# EAGLE design Linear_scale_digitizer (EAGLE 9.2.0)
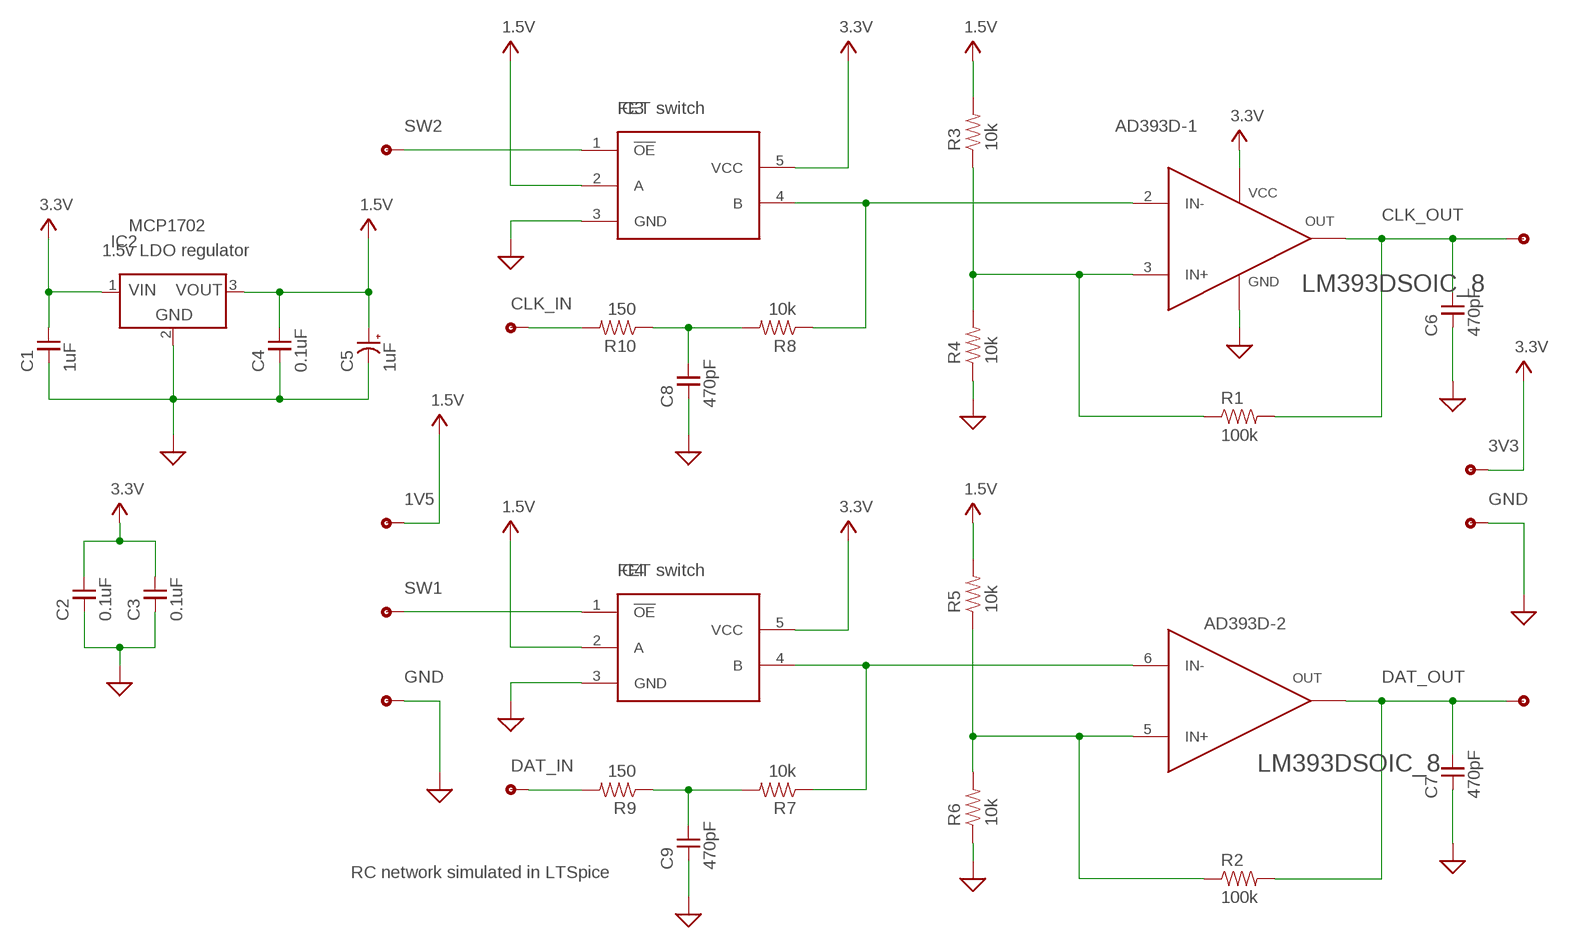
[diagram p0: schematic, sheet 1]

## Parts
C1  1uF  CAPACITOR0805  [0805]
C2  0.1uF  CAPACITOR0805  [0805]
C3  0.1uF  CAPACITOR0805  [0805]
C4  0.1uF  CAPACITOR0805  [0805]
C5  1uF  CAPACITOR+0805  [0805]
C6  470pF  CAPACITOR0805  [0805]
C7  470pF  CAPACITOR0805  [0805]
C8  470pF  CAPACITOR0805  [0805]
C9  470pF  CAPACITOR0805  [0805]
IC1  LM393DSOIC_8  [SO_8]
IC2  MCP1702  [SOT-23A]
IC3  SN74CB3T1G125  [SOT_23-5]
IC4  SN74CB3T1G125  [SOT_23-5]
R1  100k  RESISTORSMD0805  [0805]
R2  100k  RESISTORSMD0805  [0805]
R3  10k  RESISTORSMD0805  [0805]
R4  10k  RESISTORSMD0805  [0805]
R5  10k  RESISTORSMD0805  [0805]
R6  10k  RESISTORSMD0805  [0805]
R7  10k  RESISTORSMD0805  [0805]
R8  10k  RESISTORSMD0805  [0805]
R9  150  RESISTORSMD0805  [0805]
R10  150  RESISTORSMD0805  [0805]
TP1  TP  [TP]
TP2  TP  [TP]
TP3  TP  [TP]
TP4  TP  [TP]
TP5  TP  [TP]
TP6  TP  [TP]
TP7  TP  [TP]
TP8  TP  [TP]
TP9  TP  [TP]
TP10  TP  [TP]

## Nets
1V5: C4.2 C5.1 IC2.3(VOUT) IC3.2(A) IC4.2(A) R3.2 R5.2 TP7.P$1 ; supply symbol labelled 1.5V
3V3: C1.2 C2.2 C3.2 IC1.8(VCC) IC2.1(VIN) IC3.5(VCC) IC4.5(VCC) TP10.P$1 ; supply symbol labelled 3.3V
CLK_IN: R10.2 TP5.P$1
CLK_OUT: C6.2 IC1.1(OUT) R1.2 TP1.P$1
DAT_IN: R9.2 TP6.P$1
DAT_OUT: C7.2 IC1.7(OUT) R2.2 TP2.P$1
GND: C1.1 C2.1 C3.1 C4.1 C5.2 C6.1 C7.1 C8.1 C9.1 IC1.4(GND) IC2.2(GND) IC3.3(GND) IC4.3(GND) R4.1 R6.1 TP8.P$1 TP9.P$1 ; supply symbol labelled AGND
N$1: IC1.5(IN+) R2.1 R5.1 R6.2
N$3: IC1.3(IN+) R1.1 R3.1 R4.2
N$4: C8.2 R8.2 R10.1
N$5: IC1.6(IN-) IC4.4(B) R7.1
N$6: IC1.2(IN-) IC3.4(B) R8.1
N$8: C9.2 R7.2 R9.1
SW1: IC4.1(!OE) TP4.P$1
SW2: IC3.1(!OE) TP3.P$1

## Notes on the sheet
- FET switch
- AD393D-1
- 1.5v LDO regulator
- FET switch
- AD393D-2
- RC network simulated in LTSpice

## Library data of the parts
C1-C4 C6-C9 = thomas_library:CAPACITOR: This is a capacitor
C5 = thomas_library:CAPACITOR+: This is a polarized capacitor
IC1 = thomas_library:LM393D: The LM393D is a dual comparator from Texas Instruments
IC2 = thomas_library:MCP1702
IC3 IC4 = thomas_library:SN74CB3T1G125
R1-R10 = thomas_library:RESISTOR: This is a resistor
TP1-TP10 = thomas_library:TP: A test point

## Board
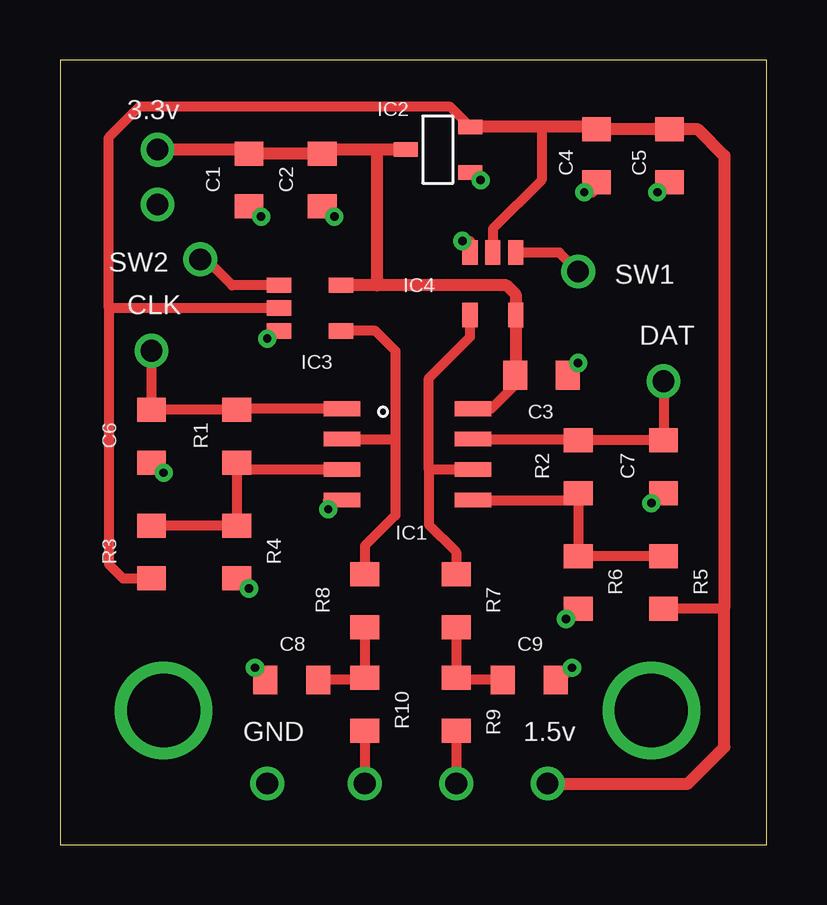
[diagram p1: board, top side]
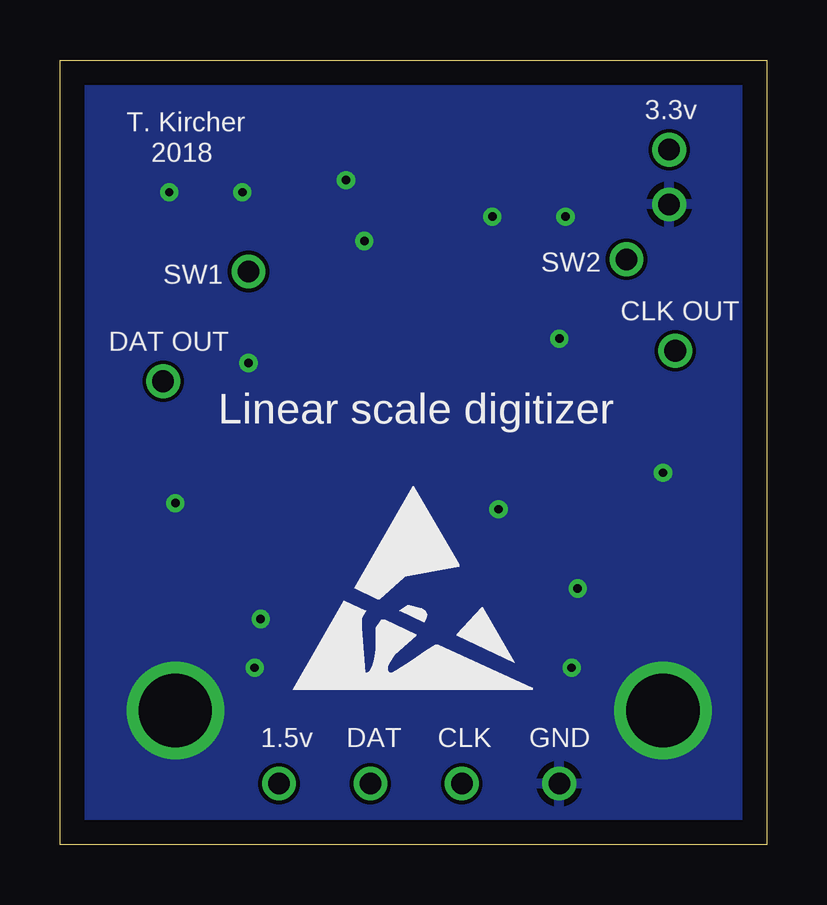
[diagram p2: board, bottom side, seen from below]

Size 29.44 x 32.69 mm. Coordinates in mm from the lower left corner, seen from the top.
Outline: 0,0 29.44,0 29.44,32.69 0,32.69 0,0
Copper layers (1*16): Top 0.035mm / dielectric 1.5mm / Bottom 0.035mm
Design rules "default": minimum track width 6mil, minimum drill 0.35mm, track to track 6mil, track to pad 6mil, pad to pad 6mil, via to via 6mil, smd to smd 6mil, copper to edge 40mil, drill to drill 6mil, minimum pad ring 10mil, minimum via ring 8mil, stop-mask expansion 4mil, vias tented up to drill 0mil, thermal gap 10mil

### Footprints (pad centres in the part's own frame; a part is rotated, then mirrored left to right if it is on the bottom)
0805 = smd 1 x 1.2: 1 -1.1,0; 2 1.1,0
SO_8 = smd 1.524 x 0.61: 1 -2.731,1.905; 2 -2.731,0.635; 3 -2.731,-0.635; 4 -2.731,-1.905; 5 2.731,-1.905; 6 2.731,-0.635; 7 2.731,0.635; 8 2.731,1.905
SOT-23A = smd 0.6 x 1: 1 0,1.35; 2 -0.95,-1.35; 3 0.95,-1.35
SOT_23-5 = smd 0.635 x 1.016: 1 -0.953,-1.295; 2 0,-1.295; 3 0.953,-1.295; 4 0.953,1.295; 5 -0.953,1.295
TP = drill 0.9: P$1 0,0

### Placement (x,y rotation side)
C1  7.87,27.69 90 top
C2  10.92,27.69 90 top
C3  20.07,19.56 180 top
C4  22.35,28.7 90 top
C5  25.4,28.7 270 top
C6  3.81,17.02 90 top
C7  25.15,15.75 90 top
C8  9.65,6.86 0 top
C9  19.56,6.86 180 top
IC1  14.48,16.26 0 top
IC2  15.75,28.96 90 top
IC3  10.41,22.35 270 top
IC4  18.03,23.37 180 top
R1  7.37,17.02 90 top
R2  21.59,15.75 90 top
R3  3.81,12.19 270 top
R4  7.37,12.19 90 top
R5  25.15,10.92 270 top
R6  21.59,10.92 90 top
R7  16.51,10.16 270 top
R8  12.7,10.16 270 top
R9  16.51,5.84 270 top
R10  12.7,5.84 270 top
TP1  3.81,20.57 0 top
TP2  25.15,19.3 0 top
TP3  5.84,24.38 0 top
TP4  21.59,23.88 0 top
TP5  12.7,2.54 0 top
TP6  16.51,2.54 0 top
TP7  20.32,2.54 0 top
TP8  8.64,2.54 0 top
TP9  4.06,26.67 0 top
TP10  4.06,28.96 0 top
U$7  [ESD_10.00]  19.81,6.35 0 bottom

### Tracks (layer width: path | path; a pad name or v marks a point on that pad's centre or on a via)
1V5
  Top 0.406: C4.2 22.25,29.91 | R5.2 27.6,9.82 27.69,9.91 | R3.2 2.62,11.09 2.03,11.68 2.03,22.35 | IC3.2 2.03,22.35 | IC4.2 18.03,25.65 20.07,27.69 20.07,29.91 | 2.03,22.35 2.03,29.46 3.3,30.73 16.27,30.73 IC2.3
  Top 0.508: 22.25,29.91 20.07,29.91 IC2.3 | C4.2 C5.1 26.59,29.8 27.69,28.7 27.69,9.91 27.69,4.06 26.16,2.54 TP7.P$1
3V3
  Top 0.406: C3.2 18.97,19.16 17.97,18.16 IC1.8
  Top 0.508: C3.2 18.99,19.58 IC4.5 18.99,22.92 18.61,23.3 13.21,23.3 | 13.21,23.3 IC3.5 | IC2.1 13.21,28.96 | 13.21,28.96 11.09,28.96 C2.2 C1.2 7.7,28.96 TP10.P$1 | 13.21,28.96 13.21,23.3
CLK_IN
  Top 0.406: R10.2 TP5.P$1
CLK_OUT
  Top 0.406: IC1.1 7.41,18.16 R1.2 C6.2 TP1.P$1
DAT_IN
  Top 0.406: R9.2 TP6.P$1
DAT_OUT
  Top 0.406: IC1.7 21.55,16.89 R2.2 C7.2 TP2.P$1
GND  (via drill 0.35, 3.05)
  Top 0.406: C5.2 24.98,27.18 v24.89,27.18 | C4.1 22.35,27.35 22.18,27.18 v21.84,27.18 | v17.53,27.69 17.42,27.69 IC2.2 | v21.59,20.07 21.17,19.64 C3.1 | C7.1 24.72,14.22 v24.64,14.22 | R6.1 21.51,9.82 v21.08,9.4 | v21.34,7.37 20.83,6.86 C9.1 | v11.43,26.16 11.09,26.59 C2.1 | v8.38,26.16 8.3,26.16 C1.1 | IC1.4 11.18,14.35 v11.18,13.97 | v7.87,10.67 7.37,11.18 R4.1 | v8.13,7.37 8.59,6.9 C8.1 | v4.32,15.49 4.15,15.66 4.06,15.66 C6.1 | IC3.3 8.95,21.4 v8.64,21.08 | v16.76,25.15 17.08,25.15 IC4.3
  other vias: 4.32,5.59 24.64,5.59
  pour Bottom: 0.25,32.51 29.21,32.51 29.21,1.02 0.25,1.02
N$1
  Top 0.406: IC1.5 21.29,14.35 R2.1 R6.2 R5.1
N$3
  Top 0.406: IC1.3 7.66,15.62 R1.1 R4.2 R3.1
N$4
  Top 0.406: R8.2 R10.1 12.62,6.86 C8.2
N$5
  Top 0.406: IC1.6 15.37,15.62 | 15.37,15.62 15.37,13.34 16.51,12.19 R7.1 | 15.37,15.62 15.37,19.43 17.08,21.15 IC4.4
N$6
  Top 0.406: IC1.2 13.84,16.89 13.97,16.76 | 13.97,16.76 13.97,13.72 12.7,12.45 R8.1 | IC3.4 13.14,21.4 13.97,20.57 13.97,16.76
N$8
  Top 0.406: R7.2 R9.1 16.51,6.86 C9.2
SW1
  Top 0.406: TP4.P$1 20.8,24.66 IC4.1
SW2
  Top 0.406: IC3.1 7.18,23.3 6.1,24.38 TP3.P$1

### Text on the board
tNames: 3.3v | SW2 | SW1 | CLK | DAT | GND | 1.5v
bNames: 3.3v | T. Kircher | 2018 | SW2 | SW1 | CLK OUT | DAT OUT | Linear scale digitizer | GND | CLK | DAT | 1.5v